# EAGLE design Battery Monitor_V3 (EAGLE 5.07)
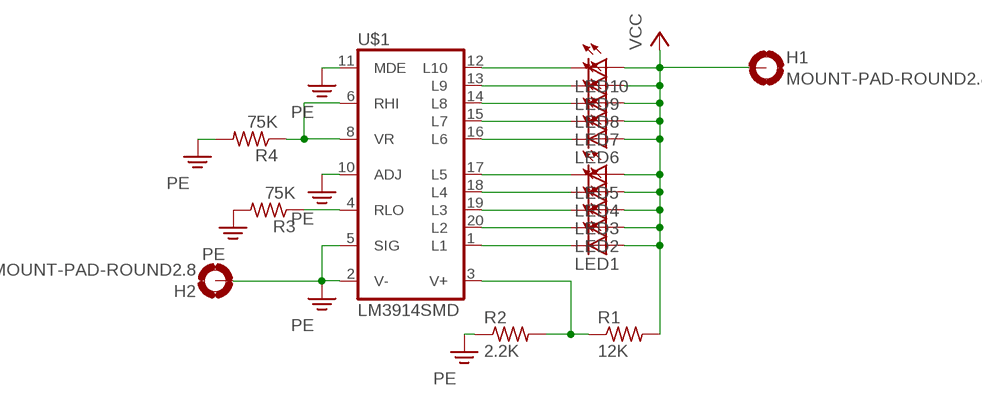
[diagram p0: schematic, sheet 1]

## Parts
H1  MOUNT-PAD-ROUND2.8  [2,8-PAD]
H2  MOUNT-PAD-ROUND2.8  [2,8-PAD]
LED1  LEDSMT1206  [1206]
LED2  LEDSMT1206  [1206]
LED3  LEDSMT1206  [1206]
LED4  LEDSMT1206  [1206]
LED5  LEDSMT1206  [1206]
LED6  LEDSMT1206  [1206]
LED7  LEDSMT1206  [1206]
LED8  LEDSMT1206  [1206]
LED9  LEDSMT1206  [1206]
LED10  LEDSMT1206  [1206]
R1  12K  R-US_R0805  [R0805]
R2  2.2K  R-US_R0805  [R0805]
R3  75K  R-US_R0805  [R0805]
R4  75K  R-US_R0805  [R0805]
U$1  LM3914SMD  [PLCC20S]

## Nets
N$1: R1.1 R2.2 U$1.3(V+)
N$2: LED10.C U$1.12(L10)
N$3: LED9.C U$1.13(L9)
N$4: LED8.C U$1.14(L8)
N$5: LED7.C U$1.15(L7)
N$7: LED6.C U$1.16(L6)
N$8: LED5.C U$1.17(L5)
N$9: LED4.C U$1.18(L4)
N$10: LED3.C U$1.19(L3)
N$11: LED2.C U$1.20(L2)
N$12: LED1.C U$1.1(L1)
N$14: R3.1 U$1.4(RLO)
N$15: R4.1 U$1.6(RHI) U$1.8(VR)
PE: H2.B2,8(MOUNT) R2.1 R3.2 R4.2 U$1.2(V-) U$1.5(SIG) U$1.10(ADJ) U$1.11(MDE)
VCC: H1.B2,8(MOUNT) LED1.A LED2.A LED3.A LED4.A LED5.A LED6.A LED7.A LED8.A LED9.A LED10.A R1.2

## Library data of the parts
H1 H2 = holes:MOUNT-PAD-ROUND: MOUNTING PAD, round
LED1-LED10 = led:LED: LED OSRAM: - CHIPLED LG R971, LG N971, LY N971, LG Q971, LY Q971, LO R971, LY R971 LH N974, LH R974 LS Q976, LO Q976, LY Q976 LO Q996 - Hyper CHIPLED LW Q18S LB Q993, LB Q99A, LB R99A - SideLED LS A670, LO A670, LY A670, LG A670, LP A670 LB A673, LV A673, LT A673, LW A673 LH A674 LY A675 LS A676, LA A676, LO A676, LY A676, LW A676 LS A679, LY A679, LG A679 - Hyper Micro SIDELED® LS Y876, LA Y876, LO Y876, LY Y876 LT Y87S - SmartLED LW L88C, LW L88S LB L89C, LB L89S, LG L890 LS L89K, LO L89K, LY L89K LS L896, LA L896, LO L896, LY L896 - TOPLED LS T670, LO T670, LY T670, LG T670, LP T670 LSG T670, LSP T670, LSY T670, LOP T670, LYG T670 LG T671, LOG T671, LSG T671 LB T673, LV T673, LT T673, LW T673 LH T674 LS T676, LA T676, LO T676, LY T676, LB T676, LH T676, LSB T676, LW T676 LB T67C, LV T67C, LT T67C, LS T67K, LO T67K, LY T67K, LW E67C LS E67B, LA E67B, LO E67B, LY E67B, LB E67C, LV E67C, LT E67C LW T67C LS T679, LY T679, LG T679 LS T770, LO T770, LY T770, LG T770, LP T770 LB T773, LV T773, LT T773, LW T773 LH T774 LS E675, LA E675, LY E675, LS T675 LS T776, LA T776, LO T776, LY T776, LB T776 LHGB T686 LT T68C, LB T68C - Hyper Mini TOPLED® LB M676 - Mini TOPLED Santana® LG M470 LS M47K, LO M47K, LY M47K Source: http://www.osram.convergy.de LUXEON: - LUMILED® LXK2-PW12-R00, LXK2-PW12-S00, LXK2-PW14-U00, LXK2-PW14-V00 LXK2-PM12-R00, LXK2-PM12-S00, LXK2-PM14-U00 LXK2-PE12-Q00, LXK2-PE12-R00, LXK2-PE12-S00, LXK2-PE14-T00, LXK2-PE14-U00 LXK2-PB12-K00, LXK2-PB12-L00, LXK2-PB12-M00, LXK2-PB14-N00, LXK2-PB14-P00, LXK2-PB14-Q00 LXK2-PR12-L00, LXK2-PR12-M00, LXK2-PR14-Q00, LXK2-PR14-R00 LXK2-PD12-Q00, LXK2-PD12-R00, LXK2-PD12-S00 LXK2-PH12-R00, LXK2-PH12-S00 LXK2-PL12-P00, LXK2-PL12-Q00, LXK2-PL12-R00 Source: www.luxeon.com KINGBRIGHT: KA-3528ASYC Source: www.kingbright.com
R1-R4 = resistor:R-US_: RESISTOR, American symbol
U$1 = linear:LM3914SMD

## Board
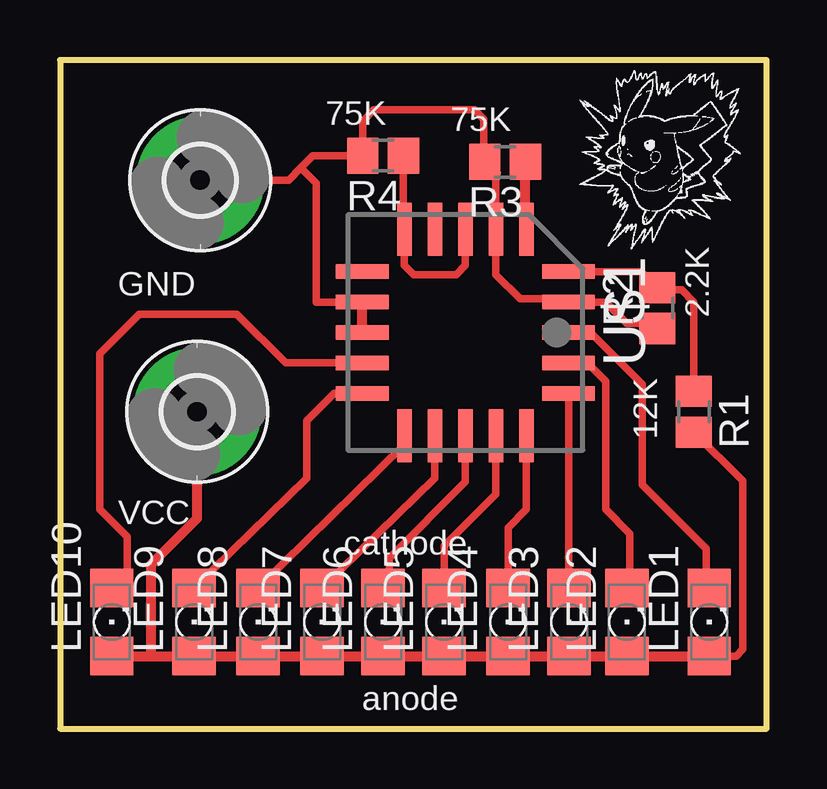
[diagram p1: board, top side]

Size 29.44 x 27.86 mm. Coordinates in mm from the lower left corner, seen from the top.
Outline: 0,0 29.44,0 29.44,27.86 0,27.86 0,0
Copper layers (1*16): Top 0.0356mm / dielectric 1.5011mm / Bottom 0.0356mm
Design rules "Aerial-2Layer": minimum track width 10mil, minimum drill 15mil, track to track 6mil, track to pad 6mil, pad to pad 6mil, via to via 6mil, smd to smd 6mil, copper to edge 15mil, drill to drill 8mil, minimum pad ring 10mil, minimum via ring 8mil, stop-mask expansion 4mil, vias tented up to drill 0mil, thermal gap 10mil

### Footprints (pad centres in the part's own frame; a part is rotated, then mirrored left to right if it is on the bottom)
2,8-PAD = drill 2.8 pad 5.334 round: B2,8 0,0
1206 = smd 1.6 x 1.803: A -1.422,0; C 1.422,0
R0805 = smd 1.3 x 1.5: 1 -0.85,0; 2 0.85,0
PLCC20S = smd 0.6 x 2.2: 1 0,4.3; 2 -1.27,4.3; 3 -2.54,4.3; 9 -2.54,-4.3; 10 -1.27,-4.3; 11 0,-4.3; 12 1.27,-4.3; 13 2.54,-4.3; 19 2.54,4.3; 20 1.27,4.3 | smd 2.2 x 0.6: 4 -4.3,2.54; 5 -4.3,1.27; 6 -4.3,0; 7 -4.3,-1.27; 8 -4.3,-2.54; 14 4.3,-2.54; 15 4.3,-1.27; 16 4.3,0; 17 4.3,1.27; 18 4.3,2.54

### Placement (x,y rotation side)
H1  5.71,13.21 180 top
H2  5.84,22.86 0 top
LED1  27.05,4.45 90 top
LED2  23.62,4.45 90 top
LED3  21.21,4.45 90 top
LED4  18.67,4.45 90 top
LED5  16,4.45 90 top
LED6  13.46,4.45 90 top
LED7  10.92,4.45 90 top
LED8  8.25,4.45 90 top
LED9  5.59,4.45 90 top
LED10  2.16,4.45 90 top
R1  26.42,13.21 270 top
R2  24.89,17.53 90 top
R3  18.54,23.62 180 top
R4  13.46,23.88 180 top
U$1  16.89,16.51 270 top

### Tracks (layer width: path | path; a pad name or v marks a point on that pad's centre or on a via)
N$1
  Top 0.305: U$1.3 24.22,19.05 R2.2 24.98,18.29 25.91,18.29 26.42,17.78 R1.1
N$2
  Top 0.305: U$1.12 9.4,15.24 7.37,17.27 3.3,17.27 1.65,15.62 1.65,9.14 2.79,8 2.79,5.87 LED10.C
N$3
  Top 0.305: 5.59,5.84 LED9.C 10.29,10.44 10.29,12.83 11.43,13.97 U$1.13
N$4
  Top 0.305: U$1.14 14.35,11.84 LED8.C
N$5
  Top 0.305: U$1.15 15.62,10.44 LED7.C
N$7
  Top 0.305: U$1.16 16.89,10.29 13.72,7.11 13.72,6.12 LED6.C
N$8
  Top 0.305: U$1.17 18.16,9.78 16,7.62 LED5.C
N$9
  Top 0.305: U$1.18 19.43,9.14 18.67,8.38 LED4.C
N$10
  Top 0.305: U$1.19 21.19,6.01 LED3.C
N$11
  Top 0.305: U$1.20 21.97,15.24 22.73,14.48 22.73,9.14 23.75,8.13 23.75,5.99 LED2.C
N$12
  Top 0.305: U$1.1 22.1,16.51 24.26,14.35 24.26,10.16 26.92,7.49 26.92,5.99 LED1.C
N$14
  Top 0.406: R3.1 19.39,20.85 U$1.4
N$15
  Top 0.305: U$1.6 16.89,19.3 16.51,18.92 14.73,18.92 14.35,19.3 U$1.8 14.35,21.46 14.31,21.5 R4.1
PE
  Top 0.305: H2.B2,8 9.53,22.86 10.03,23.37 | 10.03,23.37 10.54,23.88 R4.2 12.61,25.31 13.08,25.78 17.27,25.78 17.65,25.4 17.65,23.66 R3.2 17.44,23.88 | U$1.10 10.67,17.78 10.67,22.73 10.03,23.37 | 18.16,23.15 U$1.5 18.16,18.92 19.18,17.91 21.06,17.91 U$1.2 22.73,17.78 23.62,16.89 24.68,16.89 R2.1
  Top 0.406: 17.53,23.79 R3.2 18.16,23.15 | R4.2 12.61,23.66 | U$1.11 U$1.10
VCC
  Top 0.305: LED4.A 18.67,3.15 | LED1.A 28.17,3.02 28.45,3.3 28.45,10.33 R1.2
  Top 0.406: LED1.A LED2.A LED3.A LED4.A LED5.A LED6.A LED7.A LED8.A LED9.A 3.94,3.02 | LED10.A 3.94,3.02 | H1.B2,8 5.71,8.76 3.81,6.86 3.81,3.15 3.94,3.02

### Text on the board
tPlace: 75K | 75K | GND | 2.2K | 12K | VCC | cathode | anode